# Altium schematic sheet power_fix.SchDoc
size A4; SheetNumber: 4; SheetTotal: 4
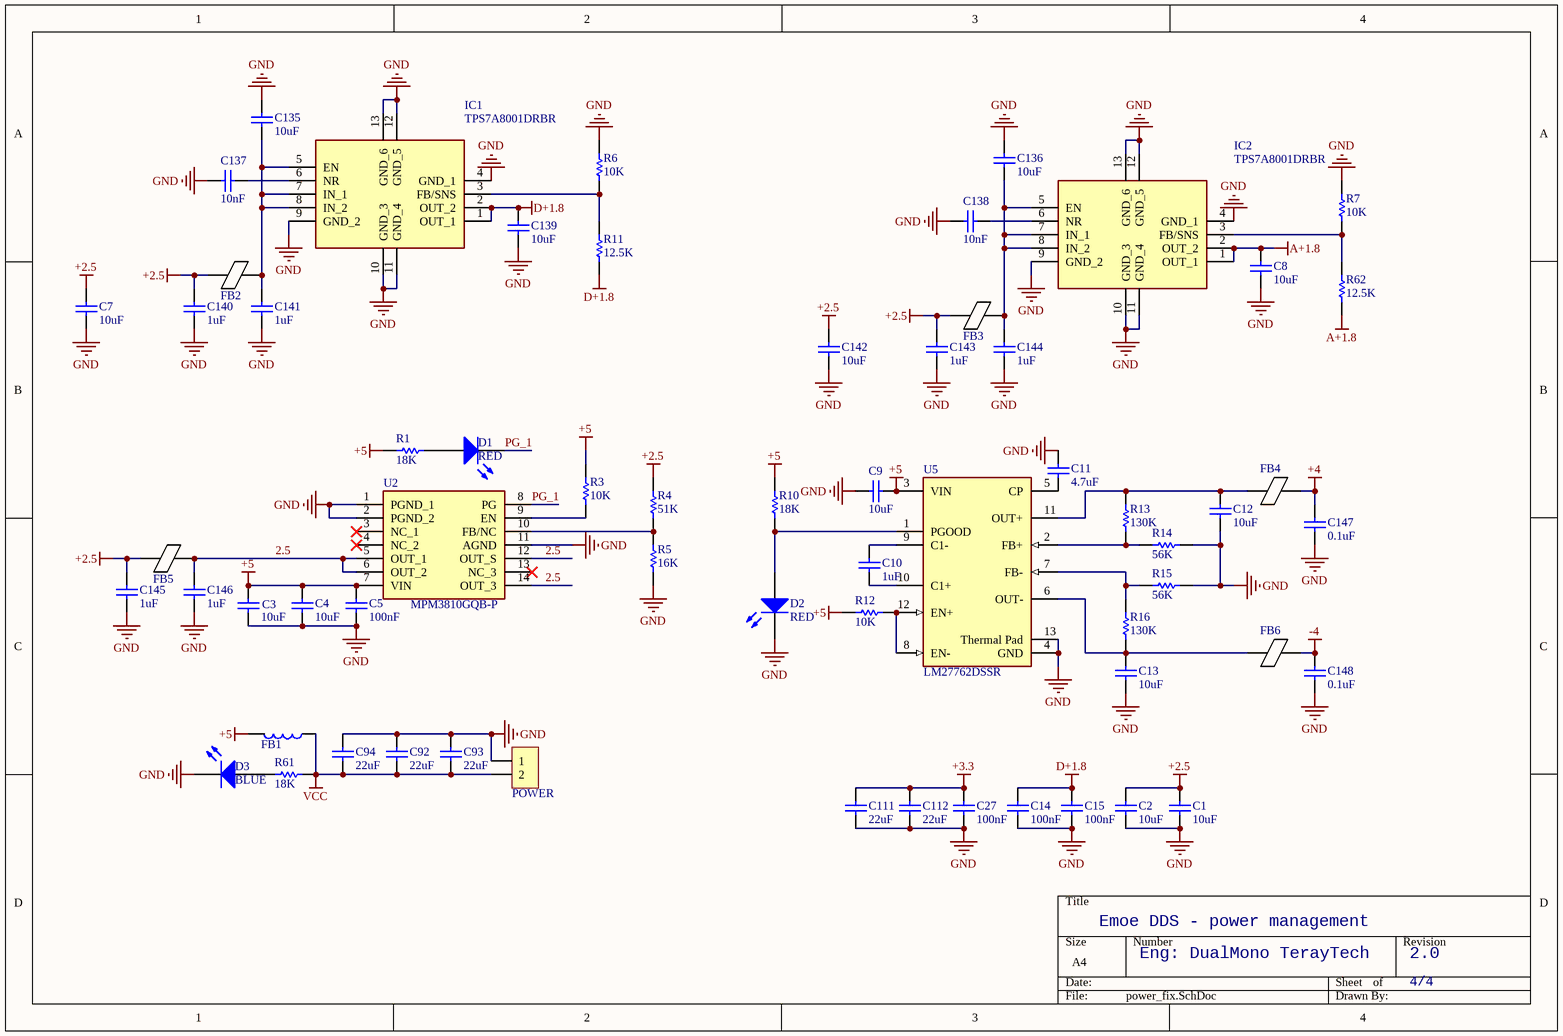
[diagram p0: power_fix.SchDoc]

## Parts
C1  10uF  [1608[0603]]
C2  10uF  [1608[0603]]
C3  10uF  [1608[0603]]
C4  10uF  [1608[0603]]
C5  100nF  [0402]
C7  10uF  [1608[0603]]
C8  10uF  [0603_C]
C9  10uF  [1608[0603]]
C10  1uF  [0402]
C11  4.7uF  [1608[0603]]
C12  10uF  [1608[0603]]
C13  10uF  [1608[0603]]
C14  100nF  [0402]
C15  100nF  [0402]
C27  100nF  [0402]
C92  22uF  [6-0805_L]
C93  22uF  [6-0805_L]
C94  22uF  [6-0805_L]
C111  22uF  [6-0805_L]
C112  22uF  [6-0805_L]
C135  10uF  [0603_C]
C136  10uF  [0603_C]
C137  10nF  [0402L]
C138  10nF  [0402L]
C139  10uF  [0603_C]
C140  1uF  [0603_C]
C141  1uF  [0603_C]
C142  10uF  [0603_C]
C143  1uF  [0603_C]
C144  1uF  [0603_C]
C145  1uF  [0603_C]
C146  1uF  [0603_C]
C147  0.1uF  [0603_C]
C148  0.1uF  [0603_C]
D1  RED  [1608[0603]]
D2  RED  [1608[0603]]
D3  BLUE  [1608[0603]]
FB1  100R,100MHz, 0603  [1608[0603]]  (value not drawn)
FB2  600Ω @ 100MHz  [0603]  (value not drawn)
FB3  600Ω @ 100MHz  [0603]  (value not drawn)
FB4  600Ω @ 100MHz  [0603]  (value not drawn)
FB5  600Ω @ 100MHz  [0603]  (value not drawn)
FB6  600Ω @ 100MHz  [0603]  (value not drawn)
IC1  TPS7A8001DRBR  [TPS7A8001DRBR]
IC2  TPS7A8001DRBR  [TPS7A8001DRBR]
POWER  HDR-1X2  [KF2510-LI-2P]  (value not drawn)
R1  18K  [0402]
R3  10K  [0402]
R4  51K  [0402]
R5  16K  [0402]
R6  10K  [0402L]
R7  10K  [0402L]
R10  18K  [0402]
R11  12.5K  [0402L]
R12  10K  [0402]
R13  130K  [0402]
R14  56K  [0402]
R15  56K  [0402]
R16  130K  [0402]
R61  18K  [0402]
R62  12.5K  [0402L]
U2  MPM3810GQB-P  [MPM3810GQB33Z]
U5  LM27762DSSR  [FP-DSS0012B-IPC_A]

## Nets
+2.5: C1.2 C2.2 C7.1 C140.2 C142.2 C143.2 C145.2 FB2.1 FB3.1 FB5.1 R4.2
+3.3: C27.1 C111.1 C112.1
+4: C147.2 FB4.1
+5: C3.1 C4.1 C5.1 C9.2 FB1.2 R1.2 R3.2 R10.2 R12.1 U2.7(VIN) U5.3(VIN)
-4: C148.2 FB6.1
A+1.8: C8.2 IC2.1(OUT_1) IC2.2(OUT_2) R62.1
D+1.8: C14.1 C15.1 C139.2 IC1.1(OUT_1) IC1.2(OUT_2) R11.1
GND: C1.1 C2.1 C3.2 C4.2 C5.2 C7.2 C8.1 C9.1 C11.2 C12.2 C13.1 C14.2 C15.2 C27.2 C92.2 C93.2 C94.2 C111.2 C112.2 C135.1 C136.1 C137.1 C138.1 C139.1 C140.1 C141.1 C142.1 C143.1 C144.1 C145.1 C146.1 C147.1 C148.1 D2.2(K) D3.2(K) IC1.4(GND_1) IC1.9(GND_2) IC1.10(GND_3) IC1.11(GND_4) IC1.12(GND_5) IC1.13(GND_6) IC2.4(GND_1) IC2.9(GND_2) IC2.10(GND_3) IC2.11(GND_4) IC2.12(GND_5) IC2.13(GND_6) POWER.1 R5.1 R6.2 R7.2 R14.1 R15.1 U2.1(PGND_1) U2.2(PGND_2) U2.11(AGND) U5.4(GND) U5.13(Thermal_Pad)
VCC: C92.1 C93.1 C94.1 FB1.1 POWER.2 R61.1
2.5: C146.2 FB5.2 U2.5(OUT_1) U2.6(OUT_2) U2.12(OUT_S) U2.14(OUT_3)
PG_1: D1.2(K) U2.8(PG)
NetC10_1: C10.1 U5.10(C1+)
NetC10_2: C10.2 U5.9(C1-)
NetC11_1: C11.1 U5.5(CP)
NetC12_1: C12.1 FB4.2 R13.1 U5.11(OUT+)
NetC13_2: C13.2 FB6.2 R16.2 U5.6(OUT-)
NetC135_2: C135.2 C141.2 FB2.2 IC1.5(EN) IC1.7(IN_1) IC1.8(IN_2)
NetC136_2: C136.2 C144.2 FB3.2 IC2.5(EN) IC2.7(IN_1) IC2.8(IN_2)
NetC137_2: C137.2 IC1.6(NR)
NetC138_2: C138.2 IC2.6(NR)
NetD1_1: D1.1(A) R1.1
NetD2_1: D2.1(A) R10.1 U5.1(PGOOD)
NetD3_1: D3.1(A) R61.2
NetIC1_3: IC1.3(FB/SNS) R6.1 R11.2
NetIC2_3: IC2.3(FB/SNS) R7.1 R62.2
NetR3_1: R3.1 U2.9(EN)
NetR4_1: R4.1 R5.2 U2.10(FB/NC)
NetR12_2: R12.2 U5.8(EN-) U5.12(EN+)
NetR13_2: R13.2 R14.2 U5.2(FB+)
NetR15_2: R15.2 R16.1 U5.7(FB-)

Not connected (* = marked no-connect by the designer): U2 3(NC_1)* 4(NC_2)* 13(NC_3)*

## Notes on the sheet
- Emoe DDS - power management
- Eng: DualMono TerayTech
- 2.0
- 4/4

## Library data of the parts
C1-C5 C7-C15 C27 C92-C94 C111 C112 C135-C148 = CAP: Capacitor; Value: 104; Published: 8-Jun-2000; LatestRevisionDate: 17-Jul-2002; LatestRevisionNote: Re-released for DXP Platform.; PackageReference: RAD-0.3; Publisher: Altium Limited
D1-D3 = LED0: Typical INFRARED GaAs LED; Published: 8-Jun-2000; LatestRevisionDate: 08-Jul-2005; LatestRevisionNote: Mech Layer 1 removed.; PackageReference: LED-0; Publisher: Altium Limited; PackageDescription: LED; 2 Leads
FB1 = FB: 磁珠
FB2-FB6 = FB: 磁珠 600Ω @ 100MHz
IC1 IC2 = TPS7A8001DRBR: Integrated Circuit; Manufacturer_Name: Texas Instruments; Datasheet Link: https://datasheet.lcsc.com/szlcsc/Texas-Instruments-TI-TPS7A8001DRBR_C105265.pdf; Height: 1mm; Manufacturer_Part_Number: TPS7A8001DRBR; Mouser Part Number: 595-TPS7A8001DRBR; Mouser Price/Stock: https://www.mouser.co.uk/ProductDetail/Texas-Instruments/TPS7A8001DRBR?qs=CLImetaeaXWznukkeYNGNw%3D%3D; Arrow Part Number: TPS7A8001DRBR; Arrow Price/Stock: https://www.arrow.com/en/products/tps7a8001drbr/texas-instruments?region=nac
POWER = Header 2: 2P接插件; 淘宝ID: 小糖豆的小窝窝; BOM名称: 2P接插件; 下单链接: https://item.taobao.com/item.htm?ft=t&id=613637044352
R1 R3-R7 R10-R16 R61 R62 = RES: Resistor; Value: 1K; Published: 8-Jun-2000; Revision: July-2002: Re-released for DXP Platform.; Publisher: Altium Limited
U2 = MPM3810GQB-P: Integrated Circuit; Manufacturer_Name: Monolithic Power Systems (MPS); Datasheet Link: https://www.monolithicpower.com/pub/media/document/MPM3810_r1.1.pdf; Height: 1mm; Manufacturer_Part_Number: MPM3810GQB-P; Mouser Part Number: 946-MPM3810GQBP; Mouser Price/Stock: https://www.mouser.co.uk/ProductDetail/Monolithic-Power-Systems-MPS/MPM3810GQB-P?qs=QEkzKklKf2S%252BUubfiGImEA%3D%3D
U5 = CMP-04918-000139-2: IC REG CHARGE PUMP ADJ DL 12WSON; Min Output Voltage: 1.5V; Max Input Voltage: 5.5V; Synchronous Rectifier: No; Output Type: Adjustable; Output Current: 250mA; Min Input Voltage: 2.7V; Quiescent Current: 390uA; Switching Frequency: 2.3MHz; Max Output Voltage: 5V; Topology: Charge Pump; Lead Free: Lead Free; Min Operating Temperature: -40°C; Max Operating Temperature: 85°C; RoHS Compliant: Yes; Packaging: Tape and Reel; Mount: Surface Mount